# Altium project TK510_Signalbakplan.PrjPcb
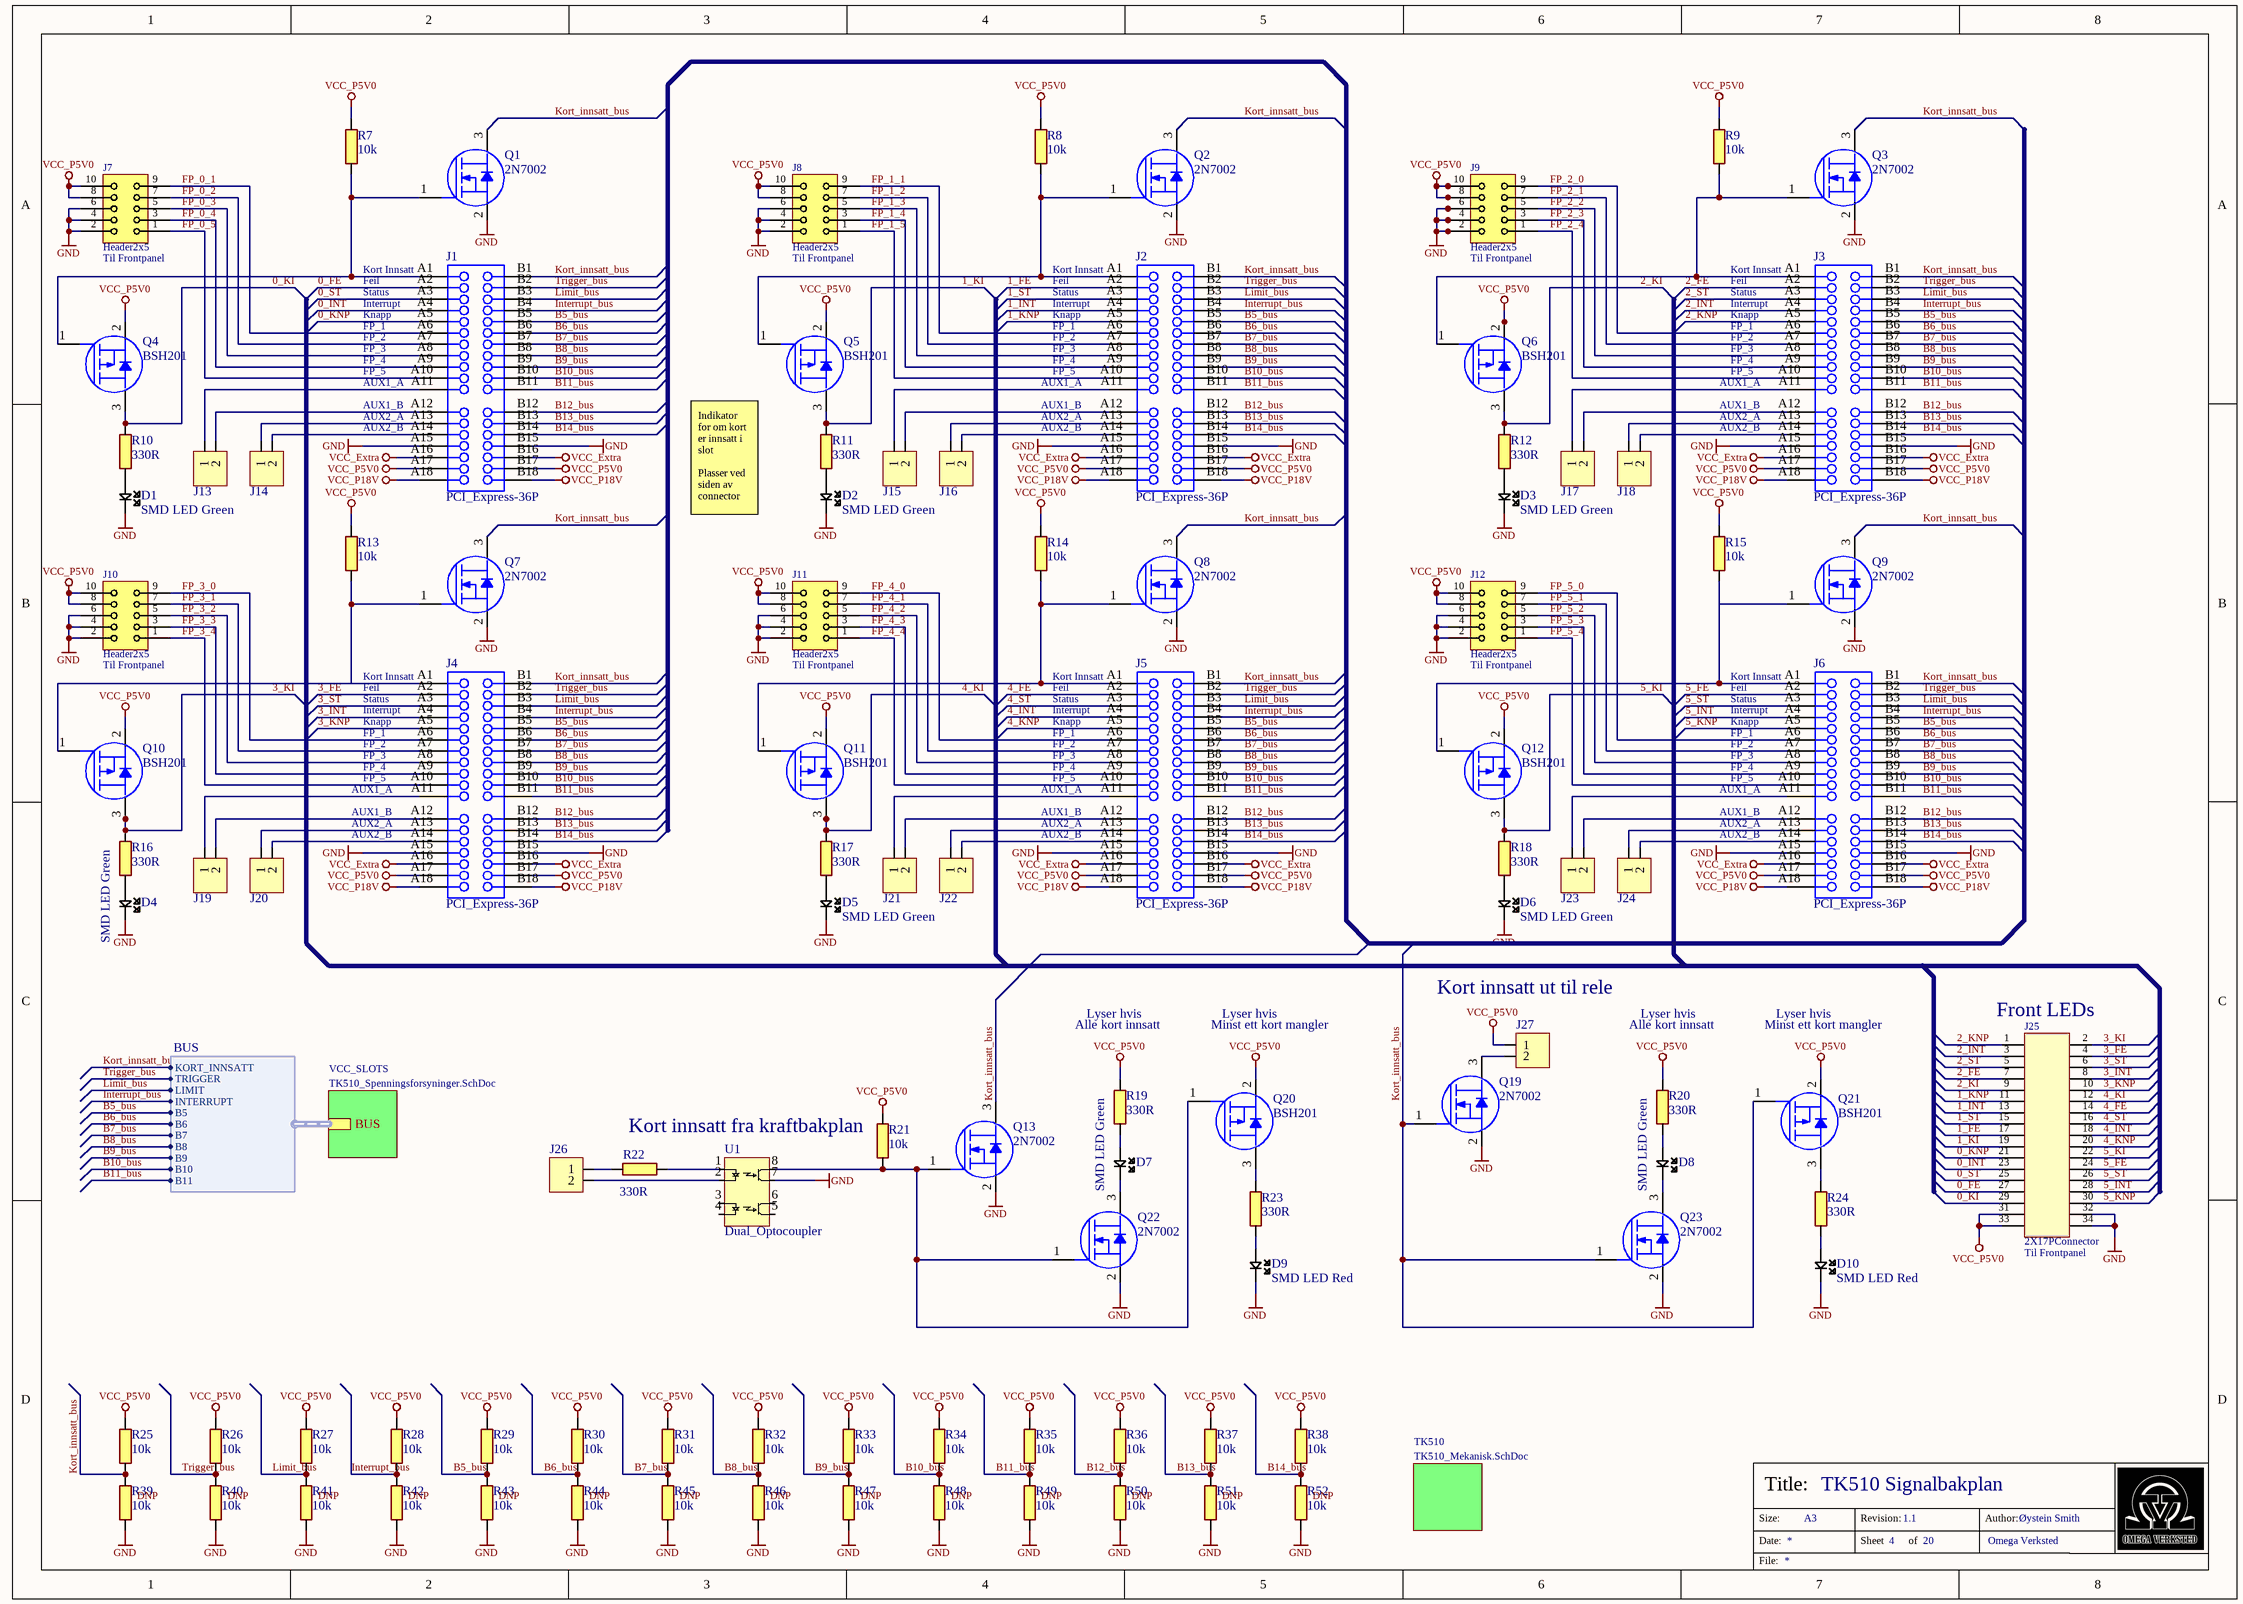
[diagram p0: TK510_Signalbakplan.SchDoc]
3 sheets, 159 parts. Net scope: hierarchical (ports join the sheet entries above them; power ports are global).
Board file: TK510_Signalbakplan.PcbDoc
Sheets:
  TK510_Signalbakplan.SchDoc
    TK510 = TK510_Mekanisk.SchDoc
    VCC_SLOTS = TK510_Spenningsforsyninger.SchDoc

## Sheet TK510_Signalbakplan.SchDoc: TK510 Signalbakplan
size A3; Author: Øystein Smith; Organization: Omega Verksted; DocumentNumber: 4; Revision: 1.1; SheetNumber: 4; SheetTotal: 20

### Parts
D1  SMD LED Green  [I_LEDC0603(1608)_N]
D2  SMD LED Green  [I_LEDC0603(1608)_N]
D3  SMD LED Green  [I_LEDC0603(1608)_N]
D4  SMD LED Green  [I_LEDC0603(1608)_N]
D5  SMD LED Green  [I_LEDC0603(1608)_N]
D6  SMD LED Green  [I_LEDC0603(1608)_N]
D7  SMD LED Green  [I_LEDC0603(1608)_N]
D8  SMD LED Green  [I_LEDC0603(1608)_N]
D9  SMD LED Red  [I_LEDC0603(1608)_N]
D10  SMD LED Red  [I_LEDC0603(1608)_N]
J1  PCI_Express-36P  [PCI_Express-36P]
J2  PCI_Express-36P  [PCI_Express-36P]
J3  PCI_Express-36P  [PCI_Express-36P]
J4  PCI_Express-36P  [PCI_Express-36P]
J5  PCI_Express-36P  [PCI_Express-36P]
J6  PCI_Express-36P  [PCI_Express-36P]
J7  Header2x5  [HDRV10W64P254_2X5_2030X900X900B]
J8  Header2x5  [HDRV10W64P254_2X5_2030X900X900B]
J9  Header2x5  [HDRV10W64P254_2X5_2030X900X900B]
J10  Header2x5  [HDRV10W64P254_2X5_2030X900X900B]
J11  Header2x5  [HDRV10W64P254_2X5_2030X900X900B]
J12  Header2x5  [HDRV10W64P254_2X5_2030X900X900B]
J13  B2B-XH-A (LF)(SN)  [JST_2P]  (value not drawn)
J14  B2B-XH-A (LF)(SN)  [JST_2P]  (value not drawn)
J15  B2B-XH-A (LF)(SN)  [JST_2P]  (value not drawn)
J16  B2B-XH-A (LF)(SN)  [JST_2P]  (value not drawn)
J17  B2B-XH-A (LF)(SN)  [JST_2P]  (value not drawn)
J18  B2B-XH-A (LF)(SN)  [JST_2P]  (value not drawn)
J19  B2B-XH-A (LF)(SN)  [JST_2P]  (value not drawn)
J20  B2B-XH-A (LF)(SN)  [JST_2P]  (value not drawn)
J21  B2B-XH-A (LF)(SN)  [JST_2P]  (value not drawn)
J22  B2B-XH-A (LF)(SN)  [JST_2P]  (value not drawn)
J23  B2B-XH-A (LF)(SN)  [JST_2P]  (value not drawn)
J24  B2B-XH-A (LF)(SN)  [JST_2P]  (value not drawn)
J25  2X17PConnector  [HDRV34W64P254_2X17_5070X900X900B]
J26  B2B-XH-A (LF)(SN)  [JST_2P]  (value not drawn)
J27  B2B-XH-A (LF)(SN)  [JST_2P]  (value not drawn)
Q1  2N7002  [SOT23-3_N]
Q2  2N7002  [SOT23-3_N]
Q3  2N7002  [SOT23-3_N]
Q4  BSH201  [SOT23-3_N]
Q5  BSH201  [SOT23-3_N]
Q6  BSH201  [SOT23-3_N]
Q7  2N7002  [SOT23-3_N]
Q8  2N7002  [SOT23-3_N]
Q9  2N7002  [SOT23-3_N]
Q10  BSH201  [SOT23-3_N]
Q11  BSH201  [SOT23-3_N]
Q12  BSH201  [SOT23-3_N]
Q13  2N7002  [SOT23-3_N]
Q19  2N7002  [SOT23-3_N]
Q20  BSH201  [SOT23-3_N]
Q21  BSH201  [SOT23-3_N]
Q22  2N7002  [SOT23-3_N]
Q23  2N7002  [SOT23-3_N]
R7  10k  [RESC0603(1608)_N]
R8  10k  [RESC0603(1608)_N]
R9  10k  [RESC0603(1608)_N]
R10  330R  [RESC0603(1608)_N]
R11  330R  [RESC0603(1608)_N]
R12  330R  [RESC0603(1608)_N]
R13  10k  [RESC0603(1608)_N]
R14  10k  [RESC0603(1608)_N]
R15  10k  [RESC0603(1608)_N]
R16  330R  [RESC0603(1608)_N]
R17  330R  [RESC0603(1608)_N]
R18  330R  [RESC0603(1608)_N]
R19  330R  [RESC0603(1608)_N]
R20  330R  [RESC0603(1608)_N]
R21  10k  [RESC0603(1608)_N]
R22  330R  [RESC0603(1608)_N]
R23  330R  [RESC0603(1608)_N]
R24  330R  [RESC0603(1608)_N]
R25  10k  [RESC0603(1608)_N]
R26  10k  [RESC0603(1608)_N]
R27  10k  [RESC0603(1608)_N]
R28  10k  [RESC0603(1608)_N]
R29  10k  [RESC0603(1608)_N]
R30  10k  [RESC0603(1608)_N]
R31  10k  [RESC0603(1608)_N]
R32  10k  [RESC0603(1608)_N]
R33  10k  [RESC0603(1608)_N]
R34  10k  [RESC0603(1608)_N]
R35  10k  [RESC0603(1608)_N]
R36  10k  [RESC0603(1608)_N]
R37  10k  [RESC0603(1608)_N]
R38  10k  [RESC0603(1608)_N]
R39  10k  [RESC0603(1608)_N]
R40  10k  [RESC0603(1608)_N]
R41  10k  [RESC0603(1608)_N]
R42  10k  [RESC0603(1608)_N]
R43  10k  [RESC0603(1608)_N]
R44  10k  [RESC0603(1608)_N]
R45  10k  [RESC0603(1608)_N]
R46  10k  [RESC0603(1608)_N]
R47  10k  [RESC0603(1608)_N]
R48  10k  [RESC0603(1608)_N]
R49  10k  [RESC0603(1608)_N]
R50  10k  [RESC0603(1608)_N]
R51  10k  [RESC0603(1608)_N]
R52  10k  [RESC0603(1608)_N]
U1  Dual_Optocoupler  [SOIC127P590X363-8N]

### Sub-sheets
TK510 = TK510_Mekanisk.SchDoc: no entries
VCC_SLOTS = TK510_Spenningsforsyninger.SchDoc: BUS (harness BUS)

### Harnesses
BUS: KORT_INNSATT, TRIGGER, LIMIT, INTERRUPT, B5, B6, B7, B8, B9, B10, B11

### Nets
GND: D1.2 D2.2 D3.2 D4.2 D5.2 D6.2 D9.2 D10.2 J1.A15 J1.B15 J2.A15 J2.B15 J3.A15 J3.B15 J4.A15 J4.B15 J5.A15 J5.B15 J6.A15 J6.B15 J7.2 J7.4 J7.6 J8.2 J8.4 J8.6 J9.2 J9.4 J9.6 J10.2 J10.4 J10.6 J11.2 J11.4 J11.6 J12.2 J12.4 J12.6 J25.32 J25.34 Q1.2(Source) Q2.2(Source) Q3.2(Source) Q7.2(Source) Q8.2(Source) Q9.2(Source) Q13.2(Source) Q19.2(Source) Q22.2(Source) Q23.2(Source) R39.1 R40.1 R41.1 R42.1 R43.1 R44.1 R45.1 R46.1 R47.1 R48.1 R49.1 R50.1 R51.1 R52.1 U1.7
VCC_Extra: J1.A16 J1.B16 J2.A16 J2.B16 J3.A16 J3.B16 J4.A16 J4.B16 J5.A16 J5.B16 J6.A16 J6.B16
VCC_P5V0: J1.A17 J1.B17 J2.A17 J2.B17 J3.A17 J3.B17 J4.A17 J4.B17 J5.A17 J5.B17 J6.A17 J6.B17 J7.8 J7.10 J8.8 J8.10 J9.8 J9.10 J10.8 J10.10 J11.8 J11.10 J12.8 J12.10 J25.31 J25.33 J27.1 Q4.2(Source) Q5.2(Source) Q6.2(Source) Q10.2(Source) Q11.2(Source) Q12.2(Source) Q20.2(Source) Q21.2(Source) R7.2 R8.2 R9.2 R13.2 R14.2 R15.2 R19.2 R20.2 R21.2 R25.2 R26.2 R27.2 R28.2 R29.2 R30.2 R31.2 R32.2 R33.2 R34.2 R35.2 R36.2 R37.2 R38.2
VCC_P18V: J1.A18 J1.B18 J2.A18 J2.B18 J3.A18 J3.B18 J4.A18 J4.B18 J5.A18 J5.B18 J6.A18 J6.B18
0_FE: J1.A2 J25.27
0_INT: J1.A4 J25.23
0_KI: J25.29 Q4.3(Drain) R10.2
0_KNP: J1.A5 J25.21
0_ST: J1.A3 J25.25
1_FE: J2.A2 J25.17
1_INT: J2.A4 J25.13
1_KI: J25.19 Q5.3(Drain) R11.2
1_KNP: J2.A5 J25.11
1_ST: J2.A3 J25.15
2_FE: J3.A2 J25.7
2_INT: J3.A4 J25.3
2_KI: J25.9 Q6.3(Drain) R12.2
2_KNP: J3.A5 J25.1
2_ST: J3.A3 J25.5
3_FE: J4.A2 J25.4
3_INT: J4.A4 J25.8
3_KI: J25.2 Q10.3(Drain) R16.2
3_KNP: J4.A5 J25.10
3_ST: J4.A3 J25.6
4_FE: J5.A2 J25.14
4_INT: J5.A4 J25.18
4_KI: J25.12 Q11.3(Drain) R17.2
4_KNP: J5.A5 J25.20
4_ST: J5.A3 J25.16
5_FE: J6.A2 J25.24
5_INT: J6.A4 J25.28
5_KI: J25.22 Q12.3(Drain) R18.2
5_KNP: J6.A5 J25.30
5_ST: J6.A3 J25.26
B5_bus: J1.B5 J2.B5 J3.B5 J4.B5 J5.B5 J6.B5 R29.1 R43.2 ; sheet VCC_SLOTS/BUS.B5
B6_bus: J1.B6 J2.B6 J3.B6 J4.B6 J5.B6 J6.B6 R30.1 R44.2 ; sheet VCC_SLOTS/BUS.B6
B7_bus: J1.B7 J2.B7 J3.B7 J4.B7 J5.B7 J6.B7 R31.1 R45.2 ; sheet VCC_SLOTS/BUS.B7
B8_bus: J1.B8 J2.B8 J3.B8 J4.B8 J5.B8 J6.B8 R32.1 R46.2 ; sheet VCC_SLOTS/BUS.B8
B9_bus: J1.B9 J2.B9 J3.B9 J4.B9 J5.B9 J6.B9 R33.1 R47.2 ; sheet VCC_SLOTS/BUS.B9
B10_bus: J1.B10 J2.B10 J3.B10 J4.B10 J5.B10 J6.B10 R34.1 R48.2 ; sheet VCC_SLOTS/BUS.B10
B11_bus: J1.B11 J2.B11 J3.B11 J4.B11 J5.B11 J6.B11 R35.1 R49.2 ; sheet VCC_SLOTS/BUS.B11
B12_bus: J1.B12 J2.B12 J3.B12 J4.B12 J5.B12 J6.B12 R36.1 R50.2
B13_bus: J1.B13 J2.B13 J3.B13 J4.B13 J5.B13 J6.B13 R37.1 R51.2
B14_bus: J1.B14 J2.B14 J3.B14 J4.B14 J5.B14 J6.B14 R38.1 R52.2
FP_0_1: J1.A6 J7.9
FP_0_2: J1.A7 J7.7
FP_0_3: J1.A8 J7.5
FP_0_4: J1.A9 J7.3
FP_0_5: J1.A10 J7.1
FP_1_1: J2.A6 J8.9
FP_1_2: J2.A7 J8.7
FP_1_3: J2.A8 J8.5
FP_1_4: J2.A9 J8.3
FP_1_5: J2.A10 J8.1
FP_2_0: J3.A6 J9.9
FP_2_1: J3.A7 J9.7
FP_2_2: J3.A8 J9.5
FP_2_3: J3.A9 J9.3
FP_2_4: J3.A10 J9.1
FP_3_0: J4.A6 J10.9
FP_3_1: J4.A7 J10.7
FP_3_2: J4.A8 J10.5
FP_3_3: J4.A9 J10.3
FP_3_4: J4.A10 J10.1
FP_4_0: J5.A6 J11.9
FP_4_1: J5.A7 J11.7
FP_4_2: J5.A8 J11.5
FP_4_3: J5.A9 J11.3
FP_4_4: J5.A10 J11.1
FP_5_0: J6.A6 J12.9
FP_5_1: J6.A7 J12.7
FP_5_2: J6.A8 J12.5
FP_5_3: J6.A9 J12.3
FP_5_4: J6.A10 J12.1
Interrupt_bus: J1.B4 J2.B4 J3.B4 J4.B4 J5.B4 J6.B4 R28.1 R42.2 ; sheet VCC_SLOTS/BUS.INTERRUPT
Kort_innsatt_bus: J1.B1 J2.B1 J3.B1 J4.B1 J5.B1 J6.B1 Q1.3(Drain) Q2.3(Drain) Q3.3(Drain) Q7.3(Drain) Q8.3(Drain) Q9.3(Drain) Q13.3(Drain) Q19.1(Gate) Q21.1(Gate) Q23.1(Gate) R25.1 R39.2 ; sheet VCC_SLOTS/BUS.KORT_INNSATT
Limit_bus: J1.B3 J2.B3 J3.B3 J4.B3 J5.B3 J6.B3 R27.1 R41.2 ; sheet VCC_SLOTS/BUS.LIMIT
Trigger_bus: J1.B2 J2.B2 J3.B2 J4.B2 J5.B2 J6.B2 R26.1 R40.2 ; sheet VCC_SLOTS/BUS.TRIGGER
NetD1_1: D1.1 R10.1
NetD2_1: D2.1 R11.1
NetD3_1: D3.1 R12.1
NetD4_1: D4.1 R16.1
NetD5_1: D5.1 R17.1
NetD6_1: D6.1 R18.1
NetD7_1: D7.1 R19.1
NetD7_2: D7.2 Q22.3(Drain)
NetD8_1: D8.1 R20.1
NetD8_2: D8.2 Q23.3(Drain)
NetD9_1: D9.1 R23.1
NetD10_1: D10.1 R24.1
NetJ1_A1: J1.A1 Q1.1(Gate) Q4.1(Gate) R7.1
NetJ1_A11: J1.A11 J13.1
NetJ1_A12: J1.A12 J13.2
NetJ1_A13: J1.A13 J14.1
NetJ1_A14: J1.A14 J14.2
NetJ2_A1: J2.A1 Q2.1(Gate) Q5.1(Gate) R8.1
NetJ2_A11: J2.A11 J15.1
NetJ2_A12: J2.A12 J15.2
NetJ2_A13: J2.A13 J16.1
NetJ2_A14: J2.A14 J16.2
NetJ3_A1: J3.A1 Q3.1(Gate) Q6.1(Gate) R9.1
NetJ3_A11: J3.A11 J17.1
NetJ3_A12: J3.A12 J17.2
NetJ3_A13: J3.A13 J18.1
NetJ3_A14: J3.A14 J18.2
NetJ4_A1: J4.A1 Q7.1(Gate) Q10.1(Gate) R13.1
NetJ4_A11: J4.A11 J19.1
NetJ4_A12: J4.A12 J19.2
NetJ4_A13: J4.A13 J20.1
NetJ4_A14: J4.A14 J20.2
NetJ5_A1: J5.A1 Q8.1(Gate) Q11.1(Gate) R14.1
NetJ5_A11: J5.A11 J21.1
NetJ5_A12: J5.A12 J21.2
NetJ5_A13: J5.A13 J22.1
NetJ5_A14: J5.A14 J22.2
NetJ6_A1: J6.A1 Q9.1(Gate) Q12.1(Gate) R15.1
NetJ6_A11: J6.A11 J23.1
NetJ6_A12: J6.A12 J23.2
NetJ6_A13: J6.A13 J24.1
NetJ6_A14: J6.A14 J24.2
NetJ26_1: J26.1 R22.1
NetJ26_2: J26.2 U1.2
NetJ27_2: J27.2 Q19.3(Drain)
NetQ13_1: Q13.1(Gate) Q20.1(Gate) Q22.1(Gate) R21.1 U1.8
NetQ20_3: Q20.3(Drain) R23.2
NetQ21_3: Q21.3(Drain) R24.2
NetR22_2: R22.2 U1.1

Not connected (* = marked no-connect by the designer): U1 3 4 5 6

### Notes on the sheet
- (near J7) Til Frontpanel
- (near J8) Til Frontpanel
- (near J9) Til Frontpanel
- (near J1) Kort Innsatt
- Feil
- (near J1) Status
- Knapp
- (near J1) Interrupt
- FP_1
- (near J2) Interrupt
- (near J2) Kort Innsatt
- (near J2) Status
- (near J3) Interrupt
- (near J3) Kort Innsatt
- (near J3) Status
- FP_2
- FP_3
- FP_4
- FP_5
- (near J1) AUX1_A
- (near J1) AUX1_B
- AUX1_A
- AUX1_B
- (near J1) AUX2_A
- (near J1) AUX2_B
- AUX2_A
- AUX2_B
- (near Q5) Indikator for om kort er innsatt i slot
  Plasser ved siden av connector
- (near J10) Til Frontpanel
- (near J4) Kort Innsatt
- (near J11) Til Frontpanel
- (near J5) Kort Innsatt
- (near J12) Til Frontpanel
- (near J6) Kort Innsatt
- (near J4) Status
- (near J4) Interrupt
- (near J5) Status
- (near J5) Interrupt
- (near J6) Status
- (near J6) Interrupt
- Alle kort innsatt
- Lyser hvis
- Minst ett kort mangler
- Kort innsatt ut til rele
- (near J25) Front LEDs
- (near R21) Kort innsatt fra kraftbakplan
- (near J25) Til Frontpanel
- (near R39) DNP
- (near R40) DNP
- (near R41) DNP
- (near R42) DNP
- (near R43) DNP
- (near R44) DNP
- (near R45) DNP
- (near R46) DNP
- (near R47) DNP
- (near R48) DNP
- (near R49) DNP
- (near R50) DNP
- (near R51) DNP
- (near R52) DNP
- Size:
- Date:
- Title:
- A3
- Revision:
- Sheet
- of
- Author:
- File:

### Library data of the parts
D1-D8 = 3654: SMD; pakke_opprettet_av: 815; pris: 1; nokkelord: diode, led, lys, grønn; pakketype: 0603; id: 3654; rad: 0; rom: OV; lager_type: Fremlager; hylle: 6; antall: 1500; produsent: ebay(Litelight); komponenttype: 9; navn: SMD LED Green; pakke_opprettet: 06/07/2014 18:55:44; symbol_opprettet_av: 815; symbol_opprettet: 06/07/2014 18:59:47; dybde: 0
D9 D10 = 5143: SMD; pakke_opprettet_av: 815; pris: 1; pakketype: 0603; id: 5143; rad: 0; rom: OV; lager_type: Fremlager; dybde: 2; hylle: 6; antall: 50; leverandor_varenr: 8554641; produsent: Avago; leverandor: Farnell; komponenttype: 9; navn: SMD LED Red; pakke_opprettet: 06/07/2014 18:55:44; symbol_opprettet_av: 815; symbol_opprettet: 06/07/2014 18:59:47; nokkelord: SMD
J1-J6 = 3222: pakke_opprettet_av: 815; leverandor_varenr: 1144435; pris: 16; nokkelord: Card-edge; pakketype: TH; produsent: FCI; leverandor: Farnell; id: 3222; komponenttype: 11; navn: PCI_Express-36P; pakke_opprettet: 06/07/2014 17:26:47; symbol_opprettet_av: 815; symbol_opprettet: 06/07/2014 17:26:37
J7-J12 = 3224: Header; navn: Header 2X5 Shrouded; pakke_opprettet_av: 815; pris: 5; pakketype: TH; id: 3224; leverandor_varenr: 2215304; produsent: Amphenol; leverandor: Farnell; komponenttype: 11; pakke_opprettet: 12/07/2014 17:42:52; symbol_opprettet_av: 815; symbol_opprettet: 13/11/2014 11:03:55; nokkelord: Header
J13-J24 = 4043: JST 2pin (pris pr. stk.); pakke_opprettet_av: 815; pris: 2; nokkelord: Connector, Kontakt; pakketype: TH; id: 4043; rad: 3; rom: OV; lager_type: Fremlager; dybde: 0; hylle: 6; antall: 120; leverandor_varenr: 1516276; leverandor: Farnell; komponenttype: 11; navn: B2B-XH-A (LF)(SN); pakke_opprettet: 28/06/2014 18:25:03; symbol_opprettet_av: 815; symbol_opprettet: 28/06/2014 15:33:17; produsent: JST
J25 = 3259: Header; navn: Header 2X17 Shrouded; pakke_opprettet_av: 815; pris: 10; nokkelord: IDE; pakketype: TH; id: 3259; leverandor_varenr: 2215313; produsent: Amphenol; leverandor: Farnell; komponenttype: 11; pakke_opprettet: 12/07/2014 17:05:20; symbol_opprettet_av: 815; symbol_opprettet: 12/07/2014 17:03:56
J26 J27 = 4043: JST 2pin (pris pr. stk.); id: 4043; pakke_opprettet_av: 815; pris: 2; nokkelord: Connector, Kontakt; pakketype: TH; rad: 3; rom: OV; lager_type: Fremlager; dybde: 0; hylle: 6; antall: 120; leverandor_varenr: 1516276; leverandor: Farnell; komponenttype: 11; pakke_opprettet: 28/06/2014 18:25:03; symbol_opprettet_av: 815; symbol_opprettet: 28/06/2014 15:33:17; navn: B2B-XH-A (LF)(SN); produsent: JST
Q1-Q3 Q7-Q9 Q13 Q19 = 3075: N-Channel MOSFET 300mA; id: 3075; rad: 2; rom: OV; lager_type: Fremlager; dybde: 0; hylle: 3; antall: 810; pakke_opprettet_av: 815; symbol_opprettet_av: 774; leverandor_varenr: 3226401; pris: 1; leverandor: Farnell; pakketype: SOT-323; komponenttype: 4; produsent: Nexperia; pakke_opprettet: 08/07/2014 20:37:25; symbol_opprettet: 11/07/2014 23:17:04; navn: 2N7002
Q4-Q6 Q10-Q12 = 3085: P-Channel MOSFET 300mA; id: 3085; pakke_opprettet_av: 815; symbol_opprettet_av: 1150; leverandor_varenr: 1758073; pris: 3; produsent: NXP Semiconductors; leverandor: Farnell; pakketype: SOT; rom: OV; lager_type: Fremlager; dybde: 0; antall: 51; komponenttype: 4; Status: New; pakke_opprettet: 08/07/2014 20:37:25; symbol_opprettet: 14/09/2016 17:47:57; navn: BSH201; rad: 3; hylle: 3
Q20 Q21 = 3085: P-Channel MOSFET 300mA; id: 3085; rad: 3; rom: OV; lager_type: Fremlager; dybde: 0; antall: 51; pakke_opprettet_av: 815; symbol_opprettet_av: 1150; leverandor_varenr: 1758073; produsent: NXP Semiconductors; leverandor: Farnell; pakketype: SOT; komponenttype: 4; Status: New; hylle: 3; pakke_opprettet: 08/07/2014 20:37:25; symbol_opprettet: 14/09/2016 17:47:57; navn: BSH201; pris: 3
Q22 Q23 = 3075: N-Channel MOSFET 300mA; id: 3075; rad: 2; rom: OV; lager_type: Fremlager; dybde: 0; hylle: 3; antall: 810; pakke_opprettet_av: 815; symbol_opprettet_av: 774; leverandor_varenr: 3226401; pris: 1; produsent: Nexperia; leverandor: Farnell; pakketype: SOT-323; komponenttype: 4; pakke_opprettet: 08/07/2014 20:37:25; symbol_opprettet: 11/07/2014 23:17:04; navn: 2N7002
R7-R9 R13-R15 R21 R25-R52 = 5264: 0.1W 1% Thick film resistor; rad: 0; rom: OV; lager_type: Fremlager; dybde: 72; hylle: 2; antall: 4; pakke_opprettet_av: 815; nokkelord: Resistor Motstand; pakketype: 0603; id: 5264; leverandor_varenr: 2447230; produsent: Multicomp; leverandor: Farnell; komponenttype: 1; navn: 10k; pakke_opprettet: 08/07/2014 21:15:30; symbol_opprettet_av: 815; symbol_opprettet: 08/07/2014 21:16:33; pris: 0
R10-R12 R16-R20 R23 R24 = 5343: 0.1W 1% Thick film resistor; rad: 0; rom: OV; lager_type: Fremlager; dybde: 36; hylle: 2; antall: 45; pakke_opprettet_av: 815; nokkelord: Resistor Motstand; pakketype: 0603; id: 5343; leverandor_varenr: 2447339; produsent: Multicomp; leverandor: Farnell; komponenttype: 1; navn: 330R; pakke_opprettet: 08/07/2014 21:15:30; symbol_opprettet_av: 815; symbol_opprettet: 08/07/2014 21:16:33; pris: 0
R22 = 5343: 0.1W 1% Thick film resistor; id: 5343; rad: 0; rom: OV; lager_type: Fremlager; dybde: 36; hylle: 2; antall: 45; pakke_opprettet_av: 815; nokkelord: Resistor Motstand; pakketype: 0603; leverandor_varenr: 2447339; produsent: Multicomp; leverandor: Farnell; komponenttype: 1; pakke_opprettet: 08/07/2014 21:15:30; symbol_opprettet_av: 815; symbol_opprettet: 08/07/2014 21:16:33; navn: 330R; pris: 0
U1 = 3444: Dual Optocoupler; id: 3444; pakke_opprettet_av: 774; symbol_opprettet_av: 815; leverandor_varenr: 1086672; navn: MOCD207R2M; pris: 4; produsent: Fairchild; leverandor: Farnell; pakketype: SOIC; pakke_opprettet: 23/08/2014 14:54:32; symbol_opprettet: 28/06/2014 15:40:47

## Sheet TK510_Mekanisk.SchDoc: TK510 Mekanisk
size A3; Author: Øystein Smith; Organization: Omega Verksted; DocumentNumber: 3; Revision: 0; SheetNumber: 3; SheetTotal: 20
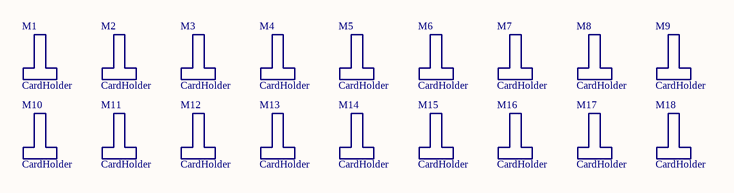
[diagram p1: TK510_Mekanisk.SchDoc]

### Parts
M1  CardHolder  [CardHolder900X1900X84000]
M2  CardHolder  [CardHolder900X1900X84000]
M3  CardHolder  [CardHolder900X1900X84000]
M4  CardHolder  [CardHolder900X1900X84000]
M5  CardHolder  [CardHolder900X1900X84000]
M6  CardHolder  [CardHolder900X1900X84000]
M7  CardHolder  [CardHolder900X1900X84000]
M8  CardHolder  [CardHolder900X1900X84000]
M9  CardHolder  [CardHolder900X1900X84000]
M10  CardHolder  [CardHolder900X1900X84000]
M11  CardHolder  [CardHolder900X1900X84000]
M12  CardHolder  [CardHolder900X1900X84000]
M13  CardHolder  [CardHolder900X1900X84000]
M14  CardHolder  [CardHolder900X1900X84000]
M15  CardHolder  [CardHolder900X1900X84000]
M16  CardHolder  [CardHolder900X1900X84000]
M17  CardHolder  [CardHolder900X1900X84000]
M18  CardHolder  [CardHolder900X1900X84000]

### Notes on the sheet
- Size:
- Date:
- Title:
- A3
- Revision:
- Sheet
- of
- Author:
- File:

### Library data of the parts
M1-M18 = 3242: Støtter kort i bakplan; navn: KortStøtte 84mm; rad: 5; rom: OV; lager_type: Fremlager; dybde: 0; hylle: 6; antall: 20; pakke_opprettet_av: 815; nokkelord: support, cardholder, kortholder; pakketype: TH; id: 3242; pakke_opprettet: 12/07/2014 20:29:43; symbol_opprettet_av: 815; symbol_opprettet: 12/07/2014 20:29:53; pris: 5

## Sheet TK510_Spenningsforsyninger.SchDoc
size A3
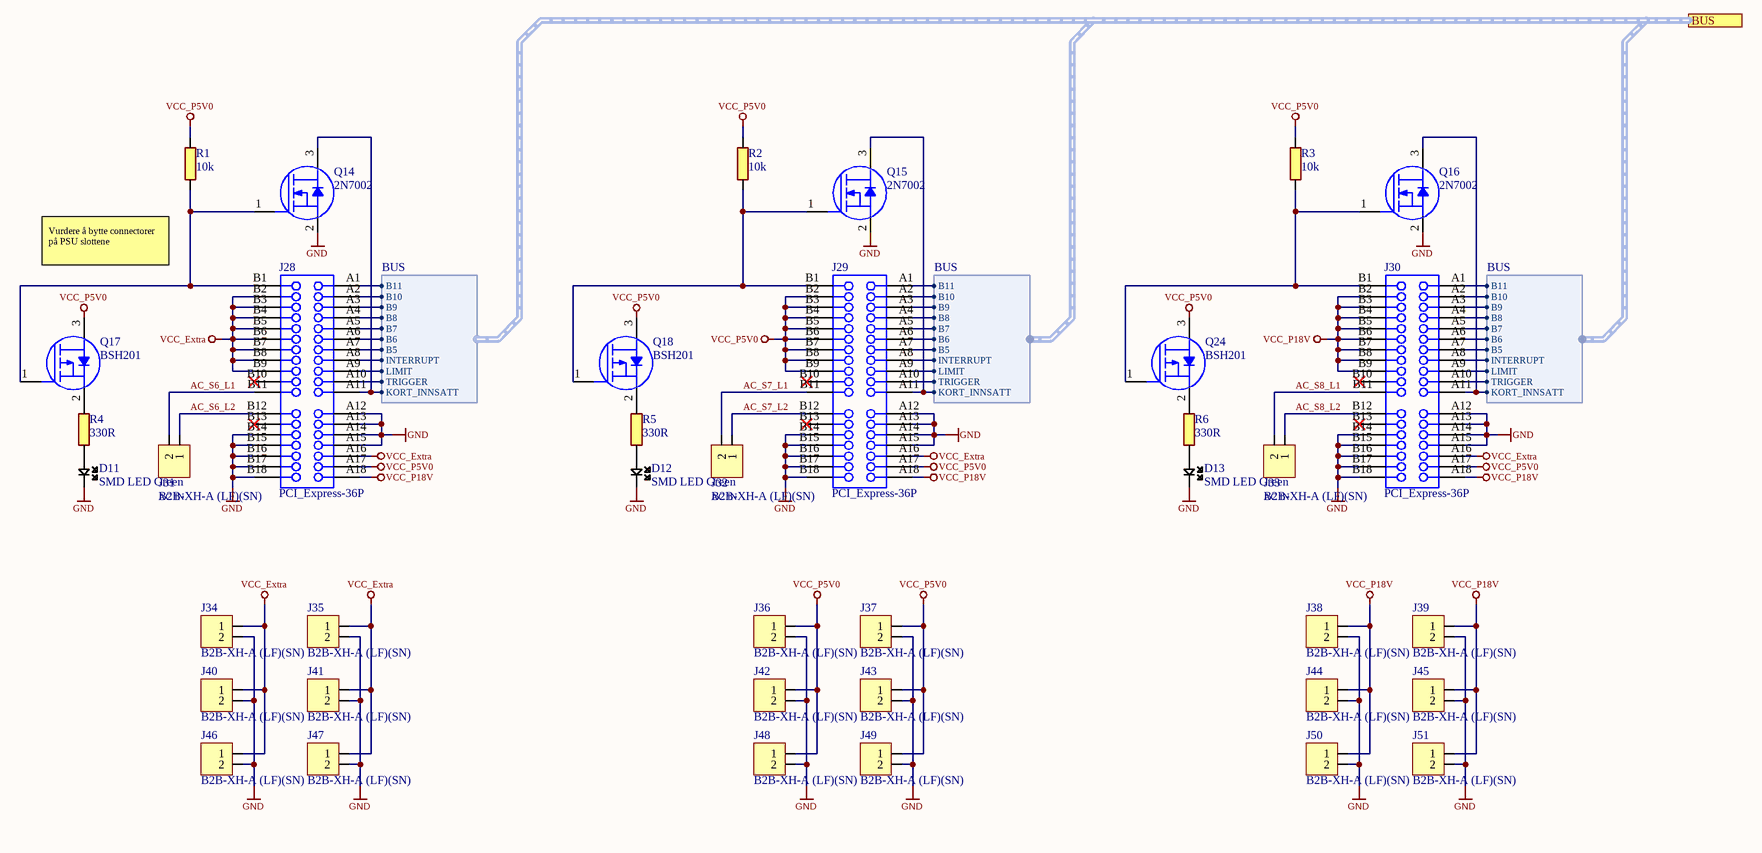
[diagram p2: TK510_Spenningsforsyninger.SchDoc]

### Parts
D11  SMD LED Green  [I_LEDC0603(1608)_N]
D12  SMD LED Green  [I_LEDC0603(1608)_N]
D13  SMD LED Green  [I_LEDC0603(1608)_N]
J28  PCI_Express-36P  [PCI_Express-36P]
J29  PCI_Express-36P  [PCI_Express-36P]
J30  PCI_Express-36P  [PCI_Express-36P]
J31  B2B-XH-A (LF)(SN)  [JST_2P]
J32  B2B-XH-A (LF)(SN)  [JST_2P]
J33  B2B-XH-A (LF)(SN)  [JST_2P]
J34  B2B-XH-A (LF)(SN)  [JST_2P]
J35  B2B-XH-A (LF)(SN)  [JST_2P]
J36  B2B-XH-A (LF)(SN)  [JST_2P]
J37  B2B-XH-A (LF)(SN)  [JST_2P]
J38  B2B-XH-A (LF)(SN)  [JST_2P]
J39  B2B-XH-A (LF)(SN)  [JST_2P]
J40  B2B-XH-A (LF)(SN)  [JST_2P]
J41  B2B-XH-A (LF)(SN)  [JST_2P]
J42  B2B-XH-A (LF)(SN)  [JST_2P]
J43  B2B-XH-A (LF)(SN)  [JST_2P]
J44  B2B-XH-A (LF)(SN)  [JST_2P]
J45  B2B-XH-A (LF)(SN)  [JST_2P]
J46  B2B-XH-A (LF)(SN)  [JST_2P]
J47  B2B-XH-A (LF)(SN)  [JST_2P]
J48  B2B-XH-A (LF)(SN)  [JST_2P]
J49  B2B-XH-A (LF)(SN)  [JST_2P]
J50  B2B-XH-A (LF)(SN)  [JST_2P]
J51  B2B-XH-A (LF)(SN)  [JST_2P]
Q14  2N7002  [SOT323_N]
Q15  2N7002  [SOT323_N]
Q16  2N7002  [SOT323_N]
Q17  BSH201  [SOT23-3_N]
Q18  BSH201  [SOT23-3_N]
Q24  BSH201  [SOT23-3_N]
R1  10k  [RESC0603(1608)_N]
R2  10k  [RESC0603(1608)_N]
R3  10k  [RESC0603(1608)_N]
R4  330R  [RESC0603(1608)_N]
R5  330R  [RESC0603(1608)_N]
R6  330R  [RESC0603(1608)_N]

### Ports
BUS (harness BUS)

### Harnesses
BUS: KORT_INNSATT, TRIGGER, LIMIT, INTERRUPT, B5, B6, B7, B8, B9, B10, B11

### Nets
GND: D11.2 D12.2 D13.2 J28.A12 J28.A13 J28.A14 J28.A15 J28.B14 J28.B15 J28.B16 J28.B17 J28.B18 J29.A12 J29.A13 J29.A14 J29.A15 J29.B14 J29.B15 J29.B16 J29.B17 J29.B18 J30.A12 J30.A13 J30.A14 J30.A15 J30.B14 J30.B15 J30.B16 J30.B17 J30.B18 J34.2 J35.2 J36.2 J37.2 J38.2 J39.2 J40.2 J41.2 J42.2 J43.2 J44.2 J45.2 J46.2 J47.2 J48.2 J49.2 J50.2 J51.2 Q14.2(Source) Q15.2(Source) Q16.2(Source)
VCC_Extra: J28.A16 J28.B2 J28.B3 J28.B4 J28.B5 J28.B6 J28.B7 J28.B8 J28.B9 J29.A16 J30.A16 J34.1 J35.1 J40.1 J41.1 J46.1 J47.1
VCC_P5V0: J28.A17 J29.A17 J29.B2 J29.B3 J29.B4 J29.B5 J29.B6 J29.B7 J29.B8 J29.B9 J30.A17 J36.1 J37.1 J42.1 J43.1 J48.1 J49.1 Q17.3(Drain) Q18.3(Drain) Q24.3(Drain) R1.2 R2.2 R3.2
VCC_P18V: J28.A18 J29.A18 J30.A18 J30.B2 J30.B3 J30.B4 J30.B5 J30.B6 J30.B7 J30.B8 J30.B9 J38.1 J39.1 J44.1 J45.1 J50.1 J51.1
AC_S6_L1: J28.B11 J31.2
AC_S6_L2: J28.B12 J31.1
AC_S7_L1: J29.B11 J32.2
AC_S7_L2: J29.B12 J32.1
AC_S8_L1: J30.B11 J33.2
AC_S8_L2: J30.B12 J33.1
B5_bus: J28.A7 J29.A7 J30.A7 ; port BUS.B5
B6_bus: J28.A6 J29.A6 J30.A6 ; port BUS.B6
B7_bus: J28.A5 J29.A5 J30.A5 ; port BUS.B7
B8_bus: J28.A4 J29.A4 J30.A4 ; port BUS.B8
B9_bus: J28.A3 J29.A3 J30.A3 ; port BUS.B9
B10_bus: J28.A2 J29.A2 J30.A2 ; port BUS.B10
B11_bus: J28.A1 J29.A1 J30.A1 ; port BUS.B11
Interrupt_bus: J28.A8 J29.A8 J30.A8 ; port BUS.INTERRUPT
Kort_innsatt_bus: J28.A11 J29.A11 J30.A11 Q14.3(Drain) Q15.3(Drain) Q16.3(Drain) ; port BUS.KORT_INNSATT
Limit_bus: J28.A9 J29.A9 J30.A9 ; port BUS.LIMIT
Trigger_bus: J28.A10 J29.A10 J30.A10 ; port BUS.TRIGGER
NetD11_1: D11.1 R4.1
NetD12_1: D12.1 R5.1
NetD13_1: D13.1 R6.1
NetJ28_B1: J28.B1 Q14.1(Gate) Q17.1(Gate) R1.1
NetJ29_B1: J29.B1 Q15.1(Gate) Q18.1(Gate) R2.1
NetJ30_B1: J30.B1 Q16.1(Gate) Q24.1(Gate) R3.1
NetQ17_2: Q17.2(Source) R4.2
NetQ18_2: Q18.2(Source) R5.2
NetQ24_2: Q24.2(Source) R6.2

Not connected (* = marked no-connect by the designer): J28 B10* B13*; J29 B10* B13*; J30 B10* B13*

### Notes on the sheet
- (near R1) Vurdere å bytte connectorer på PSU slottene
- (near J31) AC IN
- (near J32) AC IN
- (near J33) AC IN
- Size:
- Date:
- Title:
- A3
- Revision:
- Sheet
- of
- Author:
- File:

### Library data of the parts
D11-D13 = 3654: as D1 on sheet TK510_Signalbakplan; navn: SMD LED Green; pakke_opprettet: 06/07/2014 18:55:44; symbol_opprettet_av: 815; symbol_opprettet: 06/07/2014 18:59:47; dybde: 0
J28-J30 = 3222: as J1 on sheet TK510_Signalbakplan; navn: PCI_Express-36P; pakke_opprettet: 06/07/2014 17:26:47; symbol_opprettet_av: 815; symbol_opprettet: 06/07/2014 17:26:37
J31-J51 = 4043: as J13 on sheet TK510_Signalbakplan; navn: B2B-XH-A (LF)(SN); pakke_opprettet: 28/06/2014 18:25:03; symbol_opprettet_av: 815; symbol_opprettet: 28/06/2014 15:33:17; produsent: JST
Q14-Q16 = 3075: N-Channel MOSFET 300mA; id: 3075; rad: 2; rom: OV; lager_type: Fremlager; dybde: 0; hylle: 3; antall: 810; pakke_opprettet_av: 1165; symbol_opprettet_av: 774; leverandor_varenr: 1829184; pris: 1; leverandor: Farnell; pakketype: SOT-323; komponenttype: 4; pakke_opprettet: 12/05/2018 20:42:12; symbol_opprettet: 11/07/2014 23:17:04; navn: 2N7002
Q17 Q18 Q24 = 3085: P-Channel MOSFET 300mA; pakke_opprettet_av: 815; symbol_opprettet_av: 1150; leverandor_varenr: 1758073; pris: 3; pakketype: SOT; produsent: NXP Semiconductors; leverandor: Farnell; id: 3085; rom: OV; lager_type: Fremlager; dybde: 0; antall: 51; komponenttype: 4; Status: New; navn: BSH201; pakke_opprettet: 08/07/2014 20:37:25; symbol_opprettet: 14/09/2016 17:47:57; rad: 3; hylle: 3
R1-R3 = 5264: as R7 on sheet TK510_Signalbakplan; navn: 10k; pakke_opprettet: 08/07/2014 21:15:30; symbol_opprettet_av: 815; symbol_opprettet: 08/07/2014 21:16:33; pris: 0
R4-R6 = 5343: as R10 on sheet TK510_Signalbakplan; navn: 330R; pakke_opprettet: 08/07/2014 21:15:30; symbol_opprettet_av: 815; symbol_opprettet: 08/07/2014 21:16:33; pris: 0

## Nets that join several sheets
GND: TK510_Signalbakplan (65 pins), TK510_Spenningsforsyninger (51 pins)
VCC_Extra: TK510_Signalbakplan (12 pins), TK510_Spenningsforsyninger (17 pins)
VCC_P5V0: TK510_Signalbakplan (58 pins), TK510_Spenningsforsyninger (23 pins)
VCC_P18V: TK510_Signalbakplan (12 pins), TK510_Spenningsforsyninger (17 pins)
B5_bus: TK510_Signalbakplan (8 pins), TK510_Spenningsforsyninger (J28.A7 J29.A7 J30.A7)
B6_bus: TK510_Signalbakplan (8 pins), TK510_Spenningsforsyninger (J28.A6 J29.A6 J30.A6)
B7_bus: TK510_Signalbakplan (8 pins), TK510_Spenningsforsyninger (J28.A5 J29.A5 J30.A5)
B8_bus: TK510_Signalbakplan (8 pins), TK510_Spenningsforsyninger (J28.A4 J29.A4 J30.A4)
B9_bus: TK510_Signalbakplan (8 pins), TK510_Spenningsforsyninger (J28.A3 J29.A3 J30.A3)
B10_bus: TK510_Signalbakplan (8 pins), TK510_Spenningsforsyninger (J28.A2 J29.A2 J30.A2)
B11_bus: TK510_Signalbakplan (8 pins), TK510_Spenningsforsyninger (J28.A1 J29.A1 J30.A1)
Interrupt_bus: TK510_Signalbakplan (8 pins), TK510_Spenningsforsyninger (J28.A8 J29.A8 J30.A8)
Kort_innsatt_bus: TK510_Signalbakplan (18 pins), TK510_Spenningsforsyninger (6 pins)
Limit_bus: TK510_Signalbakplan (8 pins), TK510_Spenningsforsyninger (J28.A9 J29.A9 J30.A9)
Trigger_bus: TK510_Signalbakplan (8 pins), TK510_Spenningsforsyninger (J28.A10 J29.A10 J30.A10)

## Assembly variants
Release: not fitted R51001 R51001 R51005 R51006 R51006 R51010 R51011 R51015 R51016 R51021